# EAGLE design gate delay v2 main (EAGLE 7.7.0)
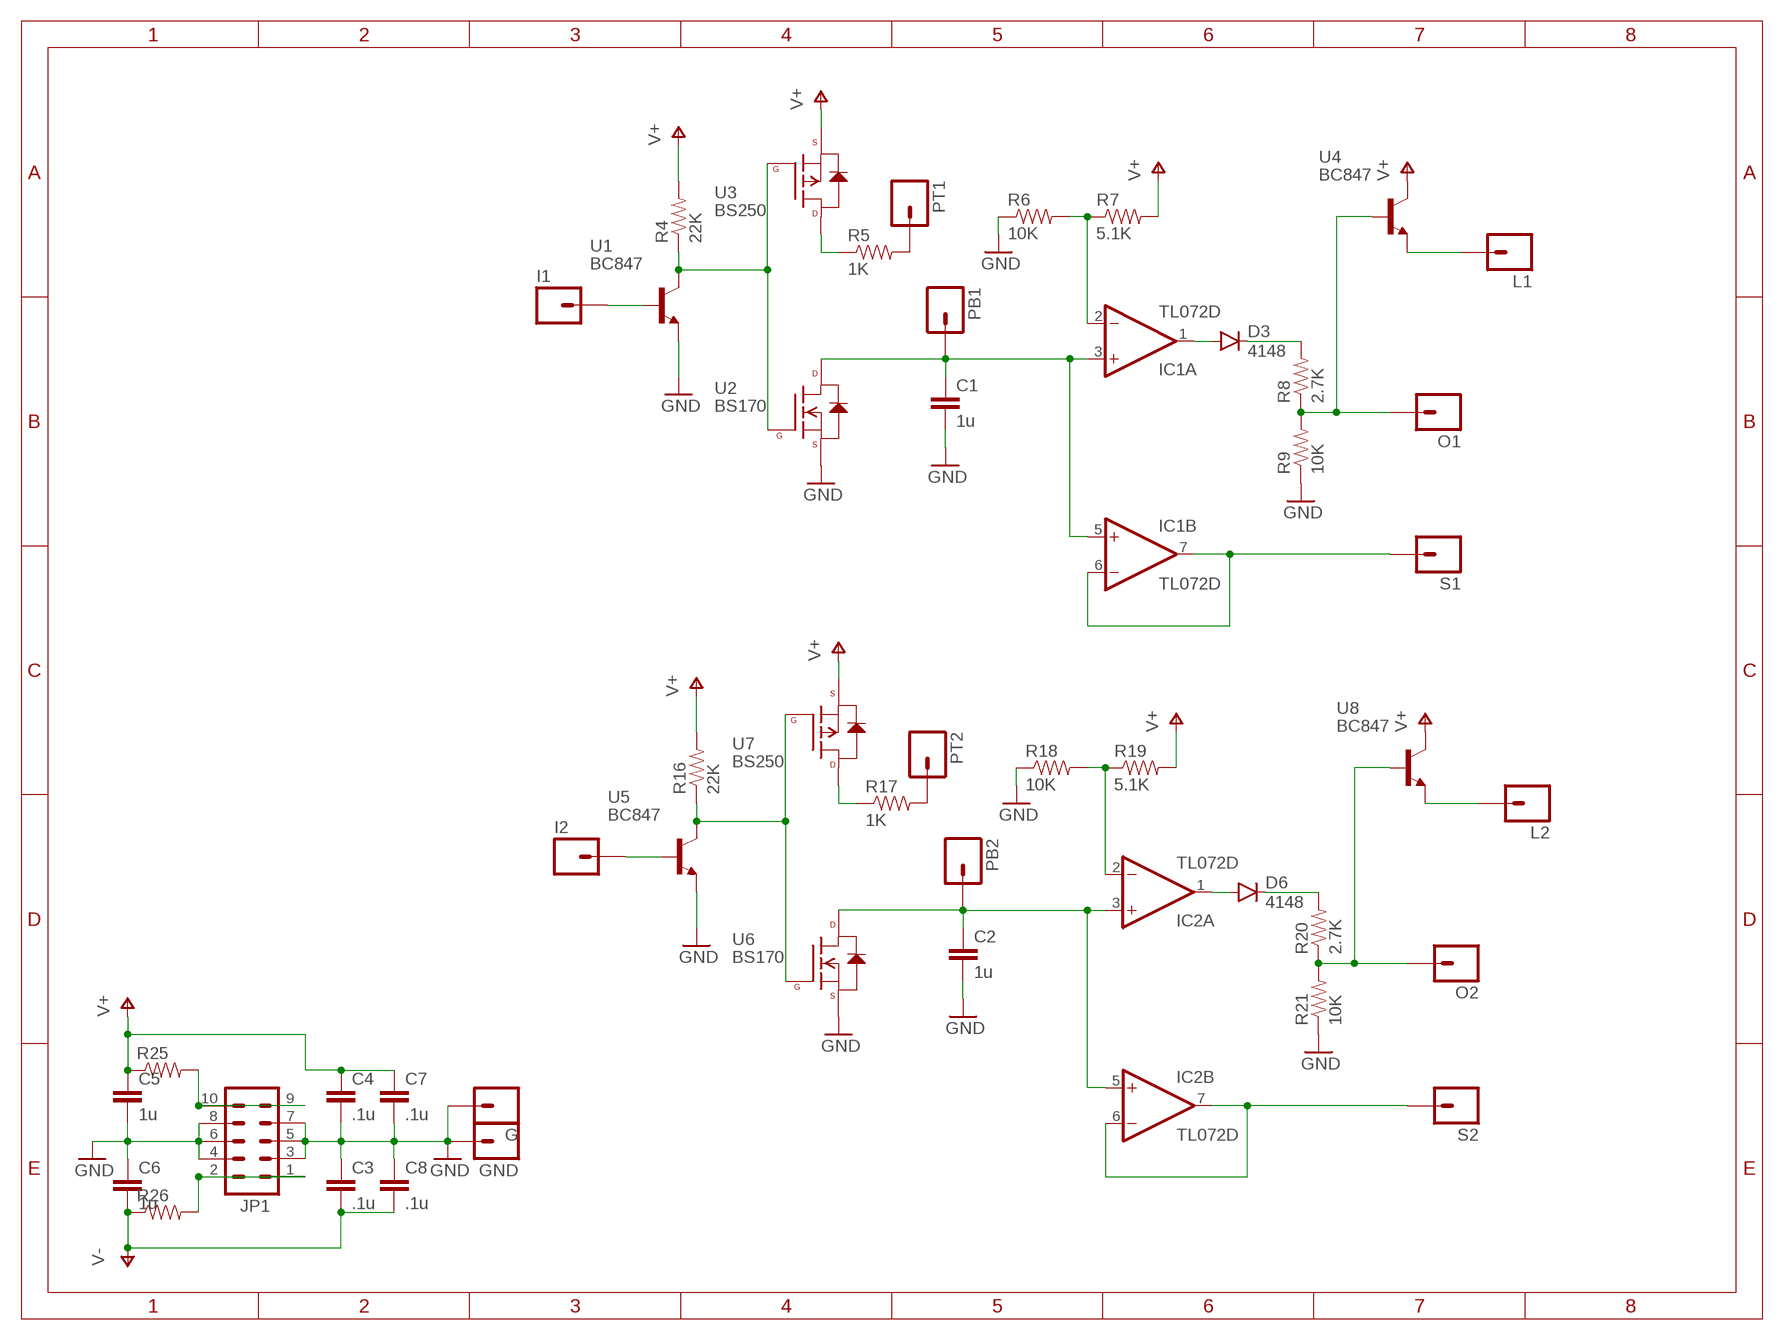
[diagram p0: schematic, sheet 1]

## Parts
C1  1u  CAP1206  [1206]
C2  1u  CAP1206  [1206]
C3  .1u  CAP0805  [0805]
C4  .1u  CAP0805  [0805]
C5  1u  CAP1206  [1206]
C6  1u  CAP1206  [1206]
C7  .1u  CAP0805  [0805]
C8  .1u  CAP0805  [0805]
D3  4148  DIODESOD123  [SOD-123]
D6  4148  DIODESOD123  [SOD-123]
G  M01PTH  [1X01]
GND  M01PTH  [1X01]
I1  M01PTH  [1X01]
I2  M01PTH  [1X01]
IC1  TL072D  [SO08]
IC2  TL072D  [SO08]
JP1  M05X2PTH  [AVR_ICSP]
L1  M01PTH  [1X01]
L2  M01PTH  [1X01]
O1  M01PTH  [1X01]
O2  M01PTH  [1X01]
PB1  M01PTH  [1X01]
PB2  M01PTH  [1X01]
PT1  M01PTH  [1X01]
PT2  M01PTH  [1X01]
R4  22K  RESISTOR0805-RES  [0805@1]
R5  1K  RESISTOR0805-RES  [0805@1]
R6  10K  RESISTOR0805-RES  [0805@1]
R7  5.1K  RESISTOR0805-RES  [0805@1]
R8  2.7K  RESISTOR0805-RES  [0805@1]
R9  10K  RESISTOR0805-RES  [0805@1]
R16  22K  RESISTOR0805-RES  [0805@1]
R17  1K  RESISTOR0805-RES  [0805@1]
R18  10K  RESISTOR0805-RES  [0805@1]
R19  5.1K  RESISTOR0805-RES  [0805@1]
R20  2.7K  RESISTOR0805-RES  [0805@1]
R21  10K  RESISTOR0805-RES  [0805@1]
R25  RESISTOR0805-RES  [0805@1]
R26  RESISTOR0805-RES  [0805@1]
S1  M01PTH  [1X01]
S2  M01PTH  [1X01]
U1  BC847  [SOT23]
U2  BS170  N-CHANNEL-MOSFET-BSS138  [SOT23-3]
U3  BS250  P-CHANNEL-MOSFET  [SOT23-3]
U4  BC847  [SOT23]
U5  BC847  [SOT23]
U6  BS170  N-CHANNEL-MOSFET-BSS138  [SOT23-3]
U7  BS250  P-CHANNEL-MOSFET  [SOT23-3]
U8  BC847  [SOT23]

## Nets
GND: C1.2 C2.2 C3.1 C4.2 C5.2 C6.1 C7.2 C8.1 G.1 GND.1 JP1.3 JP1.4 JP1.5 JP1.6 JP1.7 JP1.8 R6.1 R9.1 R18.1 R21.1 U1.2(E) U2.2(S) U5.2(E) U6.2(S)
N$1: PT1.1 R5.2
N$2: I1.1 U1.1(B)
N$3: R4.1 U1.3(C) U2.1(G) U3.1(G)
N$4: R5.1 U3.3(D)
N$5: PT2.1 R17.2
N$6: C1.1 IC1.3(A:+IN) IC1.5(B:+IN) PB1.1 U2.3(D)
N$8: O1.1 R8.1 R9.2 U4.1(B)
N$9: D3.A IC1.1(A:OUT)
N$10: IC1.2(A:-IN) R6.2 R7.1
N$11: D3.C R8.2
N$12: L1.1 U4.2(E)
N$15: IC1.6(B:-IN) IC1.7(B:OUT) S1.1
N$17: I2.1 U5.1(B)
N$18: R16.1 U5.3(C) U6.1(G) U7.1(G)
N$19: R17.1 U7.3(D)
N$21: C2.1 IC2.3(A:+IN) IC2.5(B:+IN) PB2.1 U6.3(D)
N$22: IC2.2(A:-IN) R18.2 R19.1
N$23: O2.1 R20.1 R21.2 U8.1(B)
N$24: D6.A IC2.1(A:OUT)
N$25: D6.C R20.2
N$26: L2.1 U8.2(E)
N$29: IC2.6(B:-IN) IC2.7(B:OUT) S2.1
N$31: JP1.1 JP1.2 R26.2
N$33: JP1.9 JP1.10 R25.2
V+: C4.1 C5.1 C7.1 R4.2 R7.2 R16.2 R19.2 R25.1 U3.2(S) U4.3(C) U7.2(S) U8.3(C)
V-: C3.2 C6.2 C8.2 R26.1

## Power pins joined to a net without a drawn wire
V+: IC1.8(P:V+) IC2.8(P:V+)
V-: IC1.4(P:V-) IC2.4(P:V-)

## Library data of the parts
C1-C8 = SparkFun-Capacitors:CAP: Capacitor Standard 0603 ceramic capacitor, and 0.1" leaded capacitor.
D3 D6 = SparkFun-DiscreteSemi:DIODE: Diode These are standard reverse protection diodes and small signal diodes. SMA package can handle up to about 1A. SOD-323 can handle about 200mA. What the SOD-323 package when ordering, there are some mfgs out there that are 5-pin packages.
G GND I1 I2 L1 L2 O1 O2 PB1 PB2 PT1 PT2 S1 S2 = SparkFun-Connectors:M01: Header 1 Standard 1-pin 0.1" header. Use with straight break away headers (SKU : PRT-00116), right angle break away headers (PRT-00553), swiss pins (PRT-00743), machine pins (PRT-00117), and female headers (PRT-00115).
IC1 IC2 = linear:TL072: OP AMP
JP1 = SparkFun-Connectors:M05X2: Header 5x2 Standard 10-pin dual row 0.1" header. Commonly used with AVR-ISP. Use with Spark Fun Electronics SKU: PRT-00778
R4-R9 R16-R21 R25 R26 = SparkFun-Passives:RESISTOR: Resistor Basic schematic elements and footprints for 0603, 1206, and PTH resistors.
U1 U4 U5 U8 = transistor:BC847: NPN TRANSISTOR
U2 U6 = GeekAmmo:N-CHANNEL-MOSFET: N-Channel MOSFET Mode Field Effect Transistor; DATASHEET: http://www.fairchildsemi.com/ds/BS/BSS138.pdf; DIGIKEY: BSS138TR-ND; ELEMENT14: 2323154; URL: http://au.element14.com/fairchild-semiconductor/bss138/mosfet-n-ch-50v-220ma-sot-23/dp/2323154
U3 U7 = GeekAmmo:P-CHANNEL-MOSFET: P-Channel MOSFET Mode Field Effect Transistor

## Board
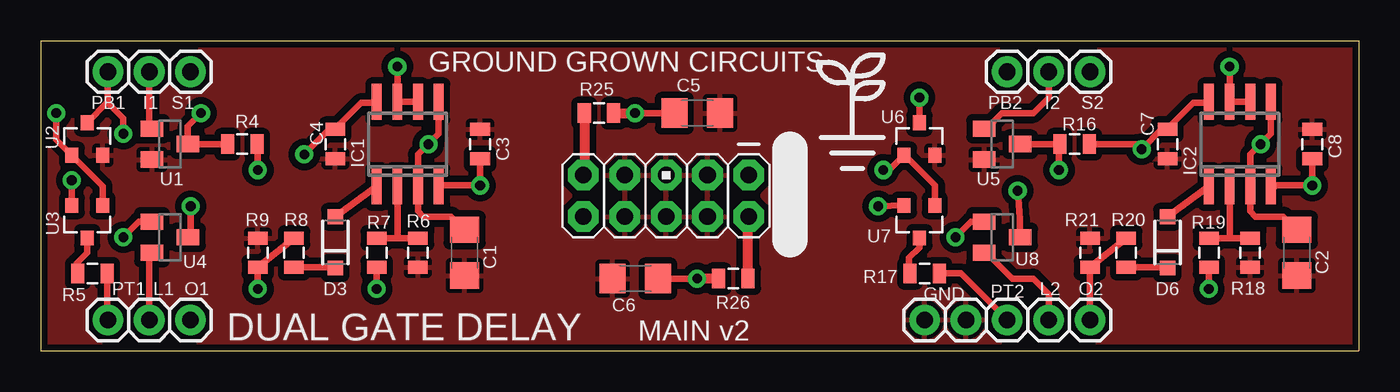
[diagram p1: board, top side]
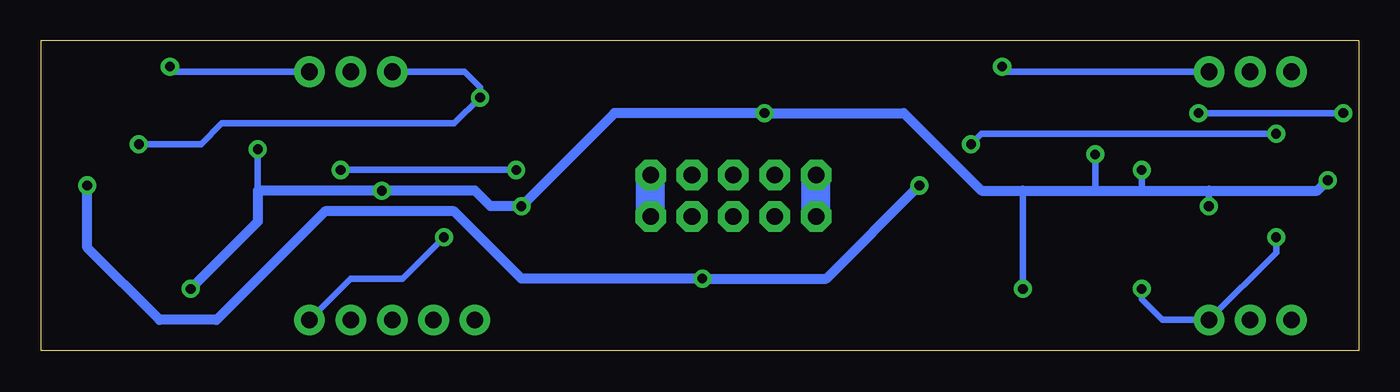
[diagram p2: board, bottom side, seen from below]

Size 80.96 x 19.05 mm. Coordinates in mm from the lower left corner, seen from the top.
Outline: 0,0 80.96,0 80.96,19.05 0,19.05 0,0
Copper layers (1*16): Top 0.035mm / dielectric 1.5mm / Bottom 0.035mm
Design rules "SparkFun": minimum track width 8mil, minimum drill 20mil, track to track 8mil, track to pad 8mil, pad to pad 8mil, via to via 8mil, smd to smd 8mil, copper to edge 8mil, drill to drill 8mil, minimum pad ring 12mil, minimum via ring 10mil, stop-mask expansion 4mil, vias tented up to drill 20mil, thermal gap 10mil

### Footprints (pad centres in the part's own frame; a part is rotated, then mirrored left to right if it is on the bottom)
1206 = smd 1.6 x 1.8: 1 -1.4,0; 2 1.4,0
0805 = smd 0.8 x 1.2: 1 -0.9,0; 2 0.9,0
SOD-123 = smd 0.9 x 0.95: A 1.575,0; C -1.575,0
1X01 = drill 1.016 pad 1.88: 1 0,0
SO08 = smd 0.6 x 2.2: 1 -1.905,-2.6; 2 -0.635,-2.6; 3 0.635,-2.6; 4 1.905,-2.6; 5 1.905,2.6; 6 0.635,2.6; 7 -0.635,2.6; 8 -1.905,2.6
AVR_ICSP = drill 1.016 pad 1.88 octagon: 1 -1.27,5.08; 2 1.27,5.08; 3 -1.27,2.54; 4 1.27,2.54; 5 -1.27,0; 6 1.27,0; 7 -1.27,-2.54; 8 1.27,-2.54; 9 -1.27,-5.08; 10 1.27,-5.08
0805@1 = smd 0.8 x 1.2: 1 -0.9,0; 2 0.9,0
SOT23 = smd 1 x 1.4: 1 -0.95,-1.1; 2 0.95,-1.1; 3 0,1.1
SOT23-3 = smd 0.8 x 0.9: 1 -0.95,-1; 2 0.95,-1; 3 0,1

### Placement (x,y rotation side)
C1  26.04,6.03 270 top
C2  77.15,6.03 270 top
C3  26.99,12.7 270 top
C4  18.1,12.7 270 top
C5  40.32,14.61 0 top
C6  36.51,4.45 0 top
C7  69.22,12.7 270 top
C8  78.11,12.7 270 top
D3  18.1,6.67 90 top
D6  69.22,6.67 90 top
G  54.29,1.91 0 top
GND  56.83,1.91 0 top
I1  6.67,17.14 0 top
I2  61.91,17.14 0 top
IC1  22.54,12.7 0 top
IC2  73.66,12.7 0 top
JP1  38.42,9.53 270 top
L1  6.67,1.91 0 top
L2  61.91,1.91 0 top
O1  9.21,1.91 0 top
O2  64.45,1.91 0 top
PB1  4.13,17.14 0 top
PB2  59.37,17.14 0 top
PT1  4.13,1.91 0 top
PT2  59.37,1.91 0 top
R4  12.38,12.7 0 top
R5  3.17,4.76 0 top
R6  23.18,6.03 90 top
R7  20.64,6.03 270 top
R8  15.56,6.03 270 top
R9  13.34,6.03 270 top
R16  63.5,12.7 0 top
R17  54.29,4.76 0 top
R18  74.3,6.03 90 top
R19  71.75,6.03 270 top
R20  66.67,6.03 270 top
R21  64.45,6.03 270 top
R25  34.29,14.61 180 top
R26  42.55,4.45 0 top
S1  9.21,17.14 0 top
S2  64.45,17.14 0 top
U1  7.94,12.7 270 top
U2  2.86,13.02 0 top
U3  2.86,7.94 180 top
U4  7.94,6.99 270 top
U5  59.05,12.7 270 top
U6  53.98,13.02 0 top
U7  53.98,7.94 180 top
U8  59.05,6.99 270 top
U$2  [LOGO_SMALL]  49.85,13.18 0 top

### Tracks (layer width: path | path; a pad name or v marks a point on that pad's centre or on a via)
GND
  pour Top (isolate 0.406): 0,0 0,19.05 80.96,19.05 80.96,0
N$1
  Top 0.406: R5.2 4.08,1.96 PT1.1
N$2
  Top 0.406: I1.1 6.67,13.82 U1.1
N$3  (via drill 0.6)
  Top 0.406: U3.1 3.81,10.12 U2.1 0.95,12.97 v0.95,14.61 | v9.84,14.61 9.04,13.8 U1.3 R4.1
  Bottom 0.406: v9.84,14.61 v0.95,14.61
N$4
  Top 0.406: U3.3 2.86,6.03 2.22,5.4 2.22,4.82 R5.1
N$5
  Top 0.406: R17.2 56.52,4.76 PT2.1
N$6  (via drill 0.6)
  Top 0.406: PB1.1 4.13,15.29 | 4.13,15.29 U2.3 | 4.13,15.29 4.13,15.24 5.08,14.29 v5.08,13.34 | IC1.5 24.45,13.34 v23.81,12.7 23.18,12.06 IC1.3 23.18,8.57 23.5,8.26 25.21,8.26 C1.1
  Bottom 0.406: v5.08,13.34 23.18,13.34 v23.81,12.7
N$8  (via drill 0.6)
  Top 0.406: R8.1 R9.2 v13.34,3.81 | U4.1 6.03,7.93 v5.08,6.99
  Bottom 0.406: v5.08,6.99 5.08,6.03 O1.1 12.06,1.91 13.34,3.17 v13.34,3.81
N$9
  Top 0.406: IC1.1 D3.A
N$10
  Top 0.406: R7.1 21.91,6.93 | 21.91,6.93 R6.2 | IC1.2 21.91,6.93
N$11
  Top 0.406: R8.2 18.06,5.13 D3.C
N$12
  Top 0.406: L1.1 6.67,5.87 U4.2
N$15  (via drill 0.6)
  Top 0.406: v21.91,17.46 IC1.7 IC1.6
  Bottom 0.406: S1.1 21.59,17.14 v21.91,17.46
N$17
  Top 0.406: U5.1 58.1,13.65 59.05,14.61 60.96,14.61 61.91,15.56 I2.1
N$18  (via drill 0.6)
  Top 0.406: U7.1 54.93,10.16 53.07,12.02 U6.1 52.12,11.11 v51.75,11.11 | U5.3 R16.1 62.55,12.65 v62.55,11.11
  Bottom 0.406: v62.55,11.11 v51.75,11.11
N$19
  Top 0.406: U7.3 53.98,6.35 53.34,5.71 53.34,4.82 R17.1
N$21  (via drill 0.6)
  Top 0.406: C2.1 76.33,8.26 74.61,8.26 74.3,8.57 IC2.3 74.3,12.06 v74.93,12.7 75.56,13.34 IC2.5 | U6.3 v53.98,15.56
  Bottom 0.406: PB2.1 54.93,17.14 53.98,16.19 v53.98,15.56 55.56,13.97 69.85,13.97 71.12,12.7 v74.93,12.7
N$22
  Top 0.406: R19.1 73.03,6.93 | 73.03,6.93 R18.2 | IC2.2 73.03,6.93
N$23  (via drill 0.6)
  Top 0.406: R20.1 R21.2 O2.1 | U8.1 57.15,7.93 v56.2,6.99
  Bottom 0.406: v56.2,6.99 58.74,4.45 61.91,4.45 O2.1
N$24
  Top 0.406: IC2.1 D6.A
N$25
  Top 0.406: R20.2 69.17,5.13 D6.C
N$26
  Top 0.406: U8.2 58.1,6.04 59.69,4.45 60.96,4.45 61.91,3.49 L2.1
N$29  (via drill 0.6)
  Top 0.406: v73.03,17.46 IC2.7 IC2.6
  Bottom 0.406: S2.1 72.71,17.14 v73.03,17.46
N$31
  Top 0.61: R26.2 43.45,8.2 JP1.2
  Bottom 1.778: JP1.2 JP1.1
N$33
  Top 0.61: R25.2 33.39,10.85 JP1.9
  Bottom 1.778: JP1.10 JP1.9
V+  (via drill 0.6)
  Top 0.406: v71.75,3.81 R19.2 | U3.2 1.91,9.84 v1.91,10.48 | U4.3 9.21,6.99 v9.21,8.89 | R4.2 13.34,12.7 v13.34,11.11 | IC1.8 20.58,15.24 19.68,15.24 18.1,13.65 C4.1 17.73,13.6 v16.19,12.06 | R7.2 v20.64,3.81 | C5.1 v36.51,14.61 | IC2.8 71.69,15.24 70.8,15.24 69.22,13.65 C7.1 68.84,13.6 v67.63,12.38 67.31,12.7 R16.2 | U7.2 v51.44,8.89 | U8.3 60.16,8.11 v60.01,9.84
  Top 0.61: R25.1 v36.51,14.61
  Bottom 0.406: v9.21,8.89 9.21,9.84 | v13.34,11.11 13.34,9.84 | v16.19,12.06 16.19,9.84 | v20.64,3.81 20.64,9.84 | v67.63,12.38 67.63,9.84
  Bottom 0.61: v1.91,10.48 2.54,9.84 9.21,9.84 13.34,9.84 16.19,9.84 20.64,9.84 23.18,9.84 27.94,14.61 v36.51,14.61 45.72,14.61 v51.44,8.89 53.34,8.89 54.29,9.84 v60.01,9.84 67.63,9.84 67.63,7.94 v71.75,3.81
V-  (via drill 0.6)
  Top 0.406: C3.2 v26.99,10.16 24.45,10.16 IC1.4 | C6.2 v40.32,4.45 | C8.2 v78.11,10.16 75.88,10.16 75.82,10.1 IC2.4
  Top 0.61: R26.1 v40.32,4.45
  Bottom 0.61: v26.99,10.16 32.7,4.45 v40.32,4.45 51.44,4.45 55.56,8.57 63.5,8.57 70.17,1.91 73.66,1.91 78.11,6.35 v78.11,10.16

### Text on the board
tPlace: GROUND GROWN CIRCUITS | DUAL GATE DELAY | MAIN v2